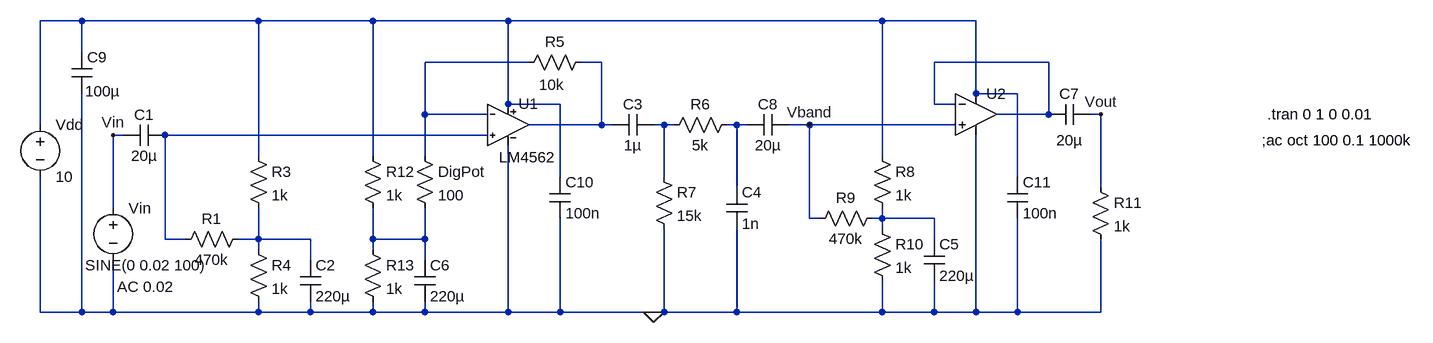
[diagram p0: schematic Final_design.asc]
Final_design.asc, the LTspice schematic file:
Version 4
SHEET 1 1816 760
WIRE -240 144 -304 144
WIRE 32 144 -240 144
WIRE 208 144 32 144
WIRE 416 144 208 144
WIRE 992 144 416 144
WIRE 1136 144 992 144
WIRE -240 192 -240 144
WIRE 448 208 288 208
WIRE 560 208 528 208
WIRE 1248 208 1072 208
WIRE 1136 256 1136 144
WIRE 1200 256 1136 256
WIRE 416 272 416 144
WIRE 496 272 416 272
WIRE 1072 272 1072 208
WIRE 1104 272 1072 272
WIRE 288 288 288 208
WIRE 384 288 288 288
WIRE 1248 288 1248 208
WIRE 1248 288 1168 288
WIRE 1328 288 1312 288
WIRE -304 304 -304 144
WIRE 560 304 560 208
WIRE 560 304 448 304
WIRE 576 304 560 304
WIRE 656 304 640 304
WIRE 672 304 656 304
WIRE 768 304 752 304
WIRE 784 304 768 304
WIRE 880 304 848 304
WIRE 1104 304 880 304
WIRE -176 320 -192 320
WIRE 384 320 -112 320
WIRE 32 352 32 144
WIRE 208 352 208 144
WIRE 288 352 288 288
WIRE 992 352 992 144
WIRE 496 384 496 272
WIRE 656 384 656 304
WIRE 1200 384 1200 256
WIRE 768 400 768 304
WIRE 1328 400 1328 288
WIRE -192 432 -192 320
WIRE 880 448 880 304
WIRE 896 448 880 448
WIRE 992 448 992 432
WIRE 992 448 976 448
WIRE 1072 448 992 448
WIRE 992 464 992 448
WIRE -112 480 -112 320
WIRE -80 480 -112 480
WIRE 32 480 32 432
WIRE 32 480 0 480
WIRE 112 480 32 480
WIRE 208 480 208 432
WIRE 288 480 288 432
WIRE 288 480 208 480
WIRE 1072 480 1072 448
WIRE 32 496 32 480
WIRE 208 496 208 480
WIRE 112 512 112 480
WIRE 288 512 288 480
WIRE -304 592 -304 384
WIRE -240 592 -240 256
WIRE -240 592 -304 592
WIRE -192 592 -192 512
WIRE -192 592 -240 592
WIRE 32 592 32 576
WIRE 32 592 -192 592
WIRE 112 592 112 576
WIRE 112 592 32 592
WIRE 208 592 208 576
WIRE 208 592 112 592
WIRE 288 592 288 576
WIRE 288 592 208 592
WIRE 416 592 416 336
WIRE 416 592 288 592
WIRE 496 592 496 448
WIRE 496 592 416 592
WIRE 640 592 496 592
WIRE 656 592 656 464
WIRE 656 592 640 592
WIRE 768 592 768 464
WIRE 768 592 656 592
WIRE 992 592 992 544
WIRE 992 592 768 592
WIRE 1072 592 1072 544
WIRE 1072 592 992 592
WIRE 1136 592 1136 320
WIRE 1136 592 1072 592
WIRE 1200 592 1200 448
WIRE 1200 592 1136 592
WIRE 1328 592 1328 480
WIRE 1328 592 1200 592
FLAG -192 320 Vin
FLAG 640 592 0
FLAG 1328 288 Vout
FLAG 880 304 Vband
SYMBOL NewOpamps\\LM4562 416 240 R0
WINDOW 3 -14 114 Left 2
SYMATTR InstName U1
SYMBOL voltage -192 416 R0
WINDOW 123 6 137 Left 2
WINDOW 39 0 0 Left 2
WINDOW 3 -43 104 Left 2
SYMATTR Value2 AC 0.02
SYMATTR Value SINE(0 0.02 100)
SYMATTR InstName Vin
SYMBOL res -96 496 R270
WINDOW 0 32 56 VTop 2
WINDOW 3 0 56 VBottom 2
SYMATTR InstName R1
SYMATTR Value 470k
SYMBOL cap -176 336 R270
WINDOW 0 32 32 VTop 2
WINDOW 3 0 32 VBottom 2
SYMATTR InstName C1
SYMATTR Value 20µ
SYMBOL res 16 336 R0
SYMATTR InstName R3
SYMATTR Value 1k
SYMBOL cap 96 512 R0
SYMATTR InstName C2
SYMATTR Value 220µ
SYMBOL voltage -304 288 R0
WINDOW 123 0 0 Left 2
WINDOW 39 0 0 Left 2
SYMATTR InstName Vdd
SYMATTR Value 10
SYMBOL res 272 336 R0
SYMATTR InstName DigPot
SYMATTR Value 100
SYMBOL res 432 224 R270
WINDOW 0 32 56 VTop 2
WINDOW 3 -3 51 VBottom 2
SYMATTR InstName R5
SYMATTR Value 10k
SYMBOL res 16 480 R0
SYMATTR InstName R4
SYMATTR Value 1k
SYMBOL cap 576 320 R270
WINDOW 0 32 32 VTop 2
WINDOW 3 0 32 VBottom 2
SYMATTR InstName C3
SYMATTR Value 1µ
SYMATTR SpiceLine Rser=0.1
SYMBOL res 640 368 R0
SYMATTR InstName R7
SYMATTR Value 15k
SYMBOL res 656 320 R270
WINDOW 0 32 56 VTop 2
WINDOW 3 0 56 VBottom 2
SYMATTR InstName R6
SYMATTR Value 5k
SYMBOL cap 752 400 R0
SYMATTR InstName C4
SYMATTR Value 1n
SYMATTR SpiceLine Rser=0.1
SYMBOL res 976 336 R0
SYMATTR InstName R8
SYMATTR Value 1k
SYMBOL cap 1056 480 R0
SYMATTR InstName C5
SYMATTR Value 220µ
SYMATTR SpiceLine Rser=0.1
SYMBOL res 976 448 R0
SYMATTR InstName R10
SYMATTR Value 1k
SYMBOL res 880 464 R270
WINDOW 0 32 56 VTop 2
WINDOW 3 0 56 VBottom 2
SYMATTR InstName R9
SYMATTR Value 470k
SYMBOL Opamps\\UniversalOpamp2 1136 288 R0
SYMATTR InstName U2
SYMBOL cap 1248 304 R270
WINDOW 0 32 32 VTop 2
WINDOW 3 -8 32 VBottom 2
SYMATTR InstName C7
SYMATTR Value 20µ
SYMBOL res 1312 384 R0
SYMATTR InstName R11
SYMATTR Value 1k
SYMBOL res 192 336 R0
SYMATTR InstName R12
SYMATTR Value 1k
SYMBOL cap 272 512 R0
SYMATTR InstName C6
SYMATTR Value 220µ
SYMBOL res 192 480 R0
SYMATTR InstName R13
SYMATTR Value 1k
SYMBOL cap 784 320 R270
WINDOW 0 32 32 VTop 2
WINDOW 3 0 32 VBottom 2
SYMATTR InstName C8
SYMATTR Value 20µ
SYMATTR SpiceLine Rser=0.1
SYMBOL cap -256 192 R0
WINDOW 3 21 60 Left 2
SYMATTR InstName C9
SYMATTR Value 100µ
SYMBOL cap 480 384 R0
SYMATTR InstName C10
SYMATTR Value 100n
SYMBOL cap 1184 384 R0
SYMATTR InstName C11
SYMATTR Value 100n
TEXT 1584 288 Left 2 !.tran 0 1 0 0.01
TEXT 1576 328 Left 2 !;ac oct 100 0.1 1000k

The netlist it stands for:
* Final_design.asc
XU1 N007 N002 N001 0 N003 LM4562  ; pins In+ In- V+ V- OUT
Vin Vin 0 SINE(0 0.02 100) AC 0.02
R1 N007 N009 470k
C1 Vin N007 20µ
R3 N001 N009 1k
C2 N009 0 220µ
Vdd N001 0 10
R§DigPot N002 N010 100
R5 N002 N003 10k
R4 N009 0 1k
C3 N003 N005 1µ Rser=0.1
R7 N005 0 15k
R6 N005 N006 5k
C4 N006 0 1n Rser=0.1
R8 N001 N008 1k
C5 N008 0 220µ Rser=0.1
R10 N008 0 1k
R9 Vband N008 470k
XU2 Vband N004 N001 0 N004 level.2 Avol=1Meg GBW=10Meg Slew=10Meg ilimit=25m rail=0 Vos=0 phimargin=45 en=0 enk=0 in=0 ink=0 Rin=500Meg  ; pins IN+ IN- V+ V- OUT
C7 N004 Vout 20µ
R11 Vout 0 1k
R12 N001 N010 1k
C6 N010 0 220µ
R13 N010 0 1k
C8 N006 Vband 20µ Rser=0.1
C9 N001 0 100µ
C10 N001 0 100n
C11 N001 0 100n
.tran 0 1 0 0.01
;ac oct 100 0.1 1000k
.lib NewOpamps\LM4562.lib
.lib UniversalOpamps2.sub
.backanno
.end